# EAGLE design scheme (EAGLE 5.11)
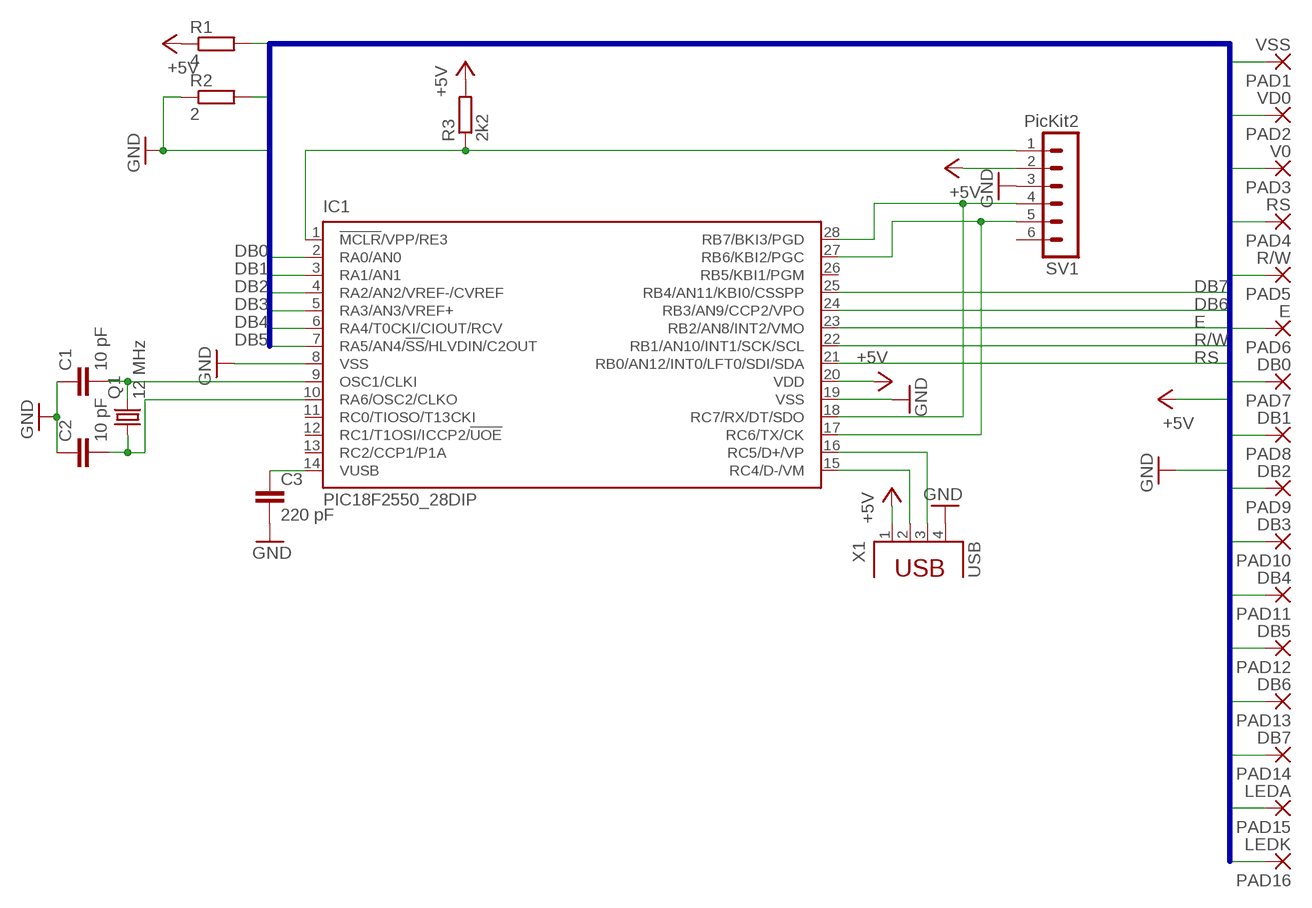
[diagram p0: schematic, sheet 1]

## Parts
C1  10 pF  C-EU050-024X044  [C050-024X044]
C2  10 pF  C-EU050-024X044  [C050-024X044]
C3  220 pF  C-EU050-024X044  [C050-024X044]
IC1  PIC18F2550_28DIP  [DIL28-3]
PAD1  VSS  2,54/0,9  [2,54/0,9]
PAD2  VD0  2,54/0,9  [2,54/0,9]
PAD3  V0  2,54/0,9  [2,54/0,9]
PAD4  RS  2,54/0,9  [2,54/0,9]
PAD5  R/W  2,54/0,9  [2,54/0,9]
PAD6  E  2,54/0,9  [2,54/0,9]
PAD7  DB0  2,54/0,9  [2,54/0,9]
PAD8  DB1  2,54/0,9  [2,54/0,9]
PAD9  DB2  2,54/0,9  [2,54/0,9]
PAD10  DB3  2,54/0,9  [2,54/0,9]
PAD11  DB4  2,54/0,9  [2,54/0,9]
PAD12  DB5  2,54/0,9  [2,54/0,9]
PAD13  DB6  2,54/0,9  [2,54/0,9]
PAD14  DB7  2,54/0,9  [2,54/0,9]
PAD15  LEDA  2,54/0,9  [2,54/0,9]
PAD16  LEDK  2,54/0,9  [2,54/0,9]
Q1  12 MHz  CRYSTALHC49S  [HC49/S]
R1  4  R-EU_0204/7  [0204/7]
R2  2  R-EU_0204/7  [0204/7]
R3  2k2  R-EU_0204/7  [0204/7]
SV1  PicKit2  MA06-1  [MA06-1]
X1  USB  PN87520  [PN87520]

## Nets
+5V: IC1.20(VDD) PAD2.1(P) R1.1 R3.2 SV1.2 X1.1
BACK: PAD15.1(P) R1.2
DB0: IC1.2(RA0/AN0) PAD7.1(P)
DB1: IC1.3(RA1/AN1) PAD8.1(P)
DB2: IC1.4(RA2/AN2/VREF-/CVREF) PAD9.1(P)
DB3: IC1.5(RA3/AN3/VREF+) PAD10.1(P)
DB4: IC1.6(RA4/T0CKI/CIOUT/RCV) PAD11.1(P)
DB5: IC1.7(RA5/AN4/!SS!/HLVDIN/C2OUT) PAD12.1(P)
DB6: IC1.24(RB3/AN9/CCP2/VPO) PAD13.1(P)
DB7: IC1.25(RB4/AN11/KBI0/CSSPP) PAD14.1(P)
E: IC1.23(RB2/AN8/INT2/VMO) PAD6.1(P)
GND: C1.1 C2.1 C3.2 IC1.8(VSS) IC1.19(VSS) PAD1.1(P) PAD16.1(P) R2.1 SV1.3 X1.4
N$1: C1.2 IC1.9(OSC1/CLKI) Q1.2
N$2: C2.2 IC1.10(RA6/OSC2/CLKO) Q1.1
N$3: IC1.15(RC4/D-/VM) X1.2
N$4: IC1.16(RC5/D+/VP) X1.3
N$5: IC1.1(!MCLR!/VPP/RE3) R3.1 SV1.1
N$6: IC1.18(RC7/RX/DT/SDO) IC1.28(RB7/BKI3/PGD) SV1.4
N$7: IC1.17(RC6/TX/CK) IC1.27(RB6/KBI2/PGC) SV1.5
N$8: C3.1 IC1.14(VUSB)
R/W: IC1.22(RB1/AN10/INT1/SCK/SCL) PAD5.1(P)
RS: IC1.21(RB0/AN12/INT0/LFT0/SDI/SDA) PAD4.1(P)
V0: PAD3.1(P) R2.2
Unconnected: IC1.11(RC0/TIOSO/T13CKI) IC1.12(RC1/T1OSI/ICCP2/!UOE) IC1.13(RC2/CCP1/P1A) IC1.26(RB5/KBI1/PGM) SV1.6

## Buses
GND,+5V,V0,RS,R/W,E,DB0,DB1,DB2,DB3,DB4,DB5,DB6,DB7,BACK,GND

## Library data of the parts
C1 C2 = resistor:C-EU: CAPACITOR, European symbol
C3 = rcl:C-EU: CAPACITOR, European symbol
IC1 = microchip:PIC18F2*_28: USB Microcontrollers with nanoWatt Technology High-Performance, Enhanced Flash, 28/40/44-Pin, Source: http://ww1.microchip.com/downloads/en/devicedoc/39632c.pdf; MF: MICROCHIP; MPN: PIC18F2550-I/SP; OC_FARNELL: 1523822; OC_NEWARK: 80K6054
PAD1-PAD16 = wirepad:2,54/0,9: THROUGH-HOLE PAD
Q1 = crystal:CRYSTAL: CRYSTAL; OC_FARNELL: 1667008; OC_NEWARK: unknown
R1-R3 = rcl:R-EU_: RESISTOR, European symbol
SV1 = con-lstb:MA06-1: PIN HEADER; OC_FARNELL: unknown; OC_NEWARK: unknown
X1 = con-berg:PN87520: BERG USB connector; OC_FARNELL: unknown; OC_NEWARK: unknown

## Board
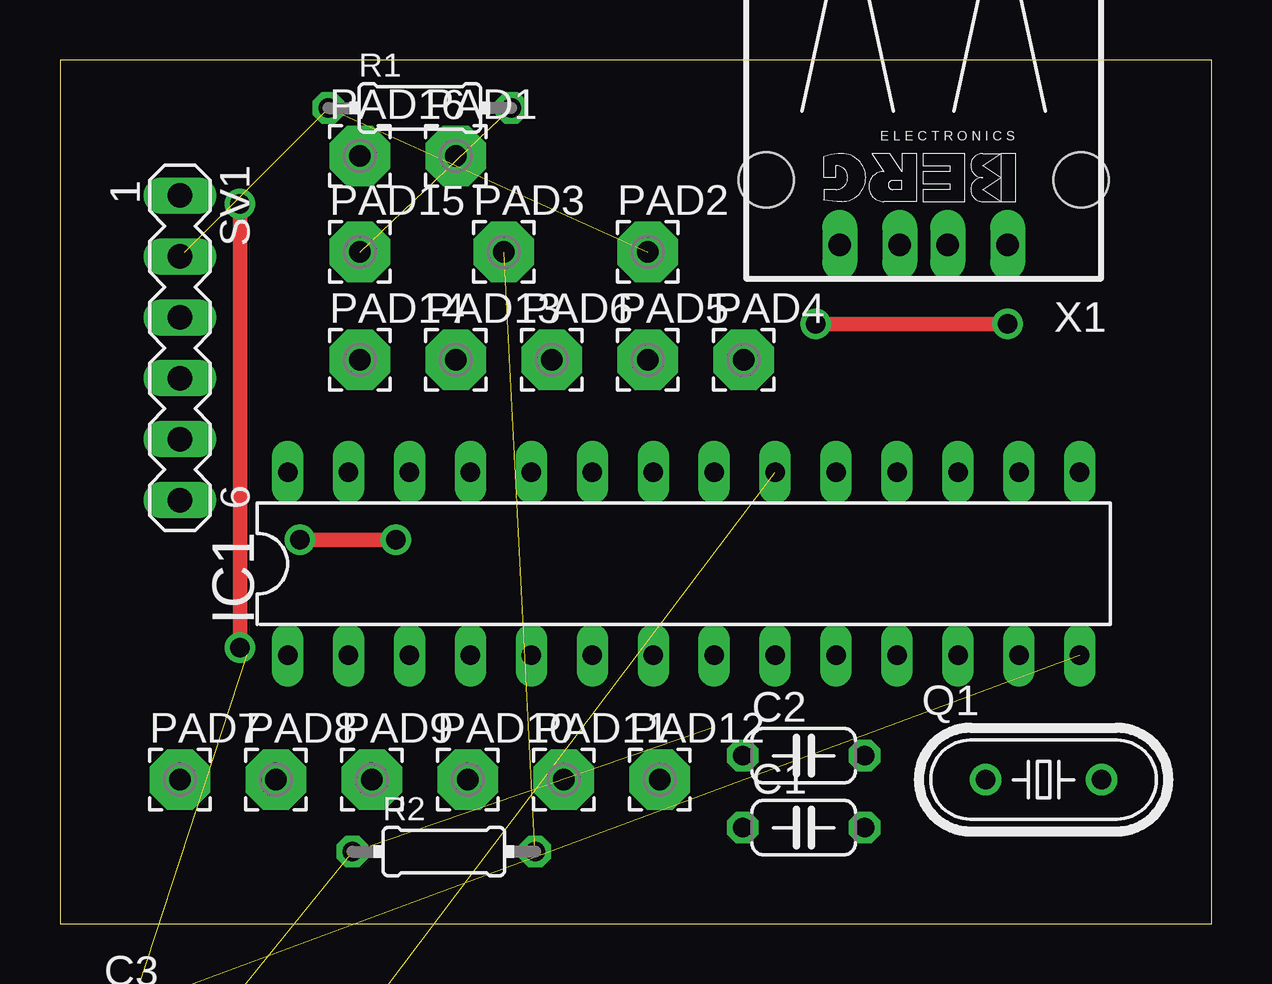
[diagram p1: board, top side]
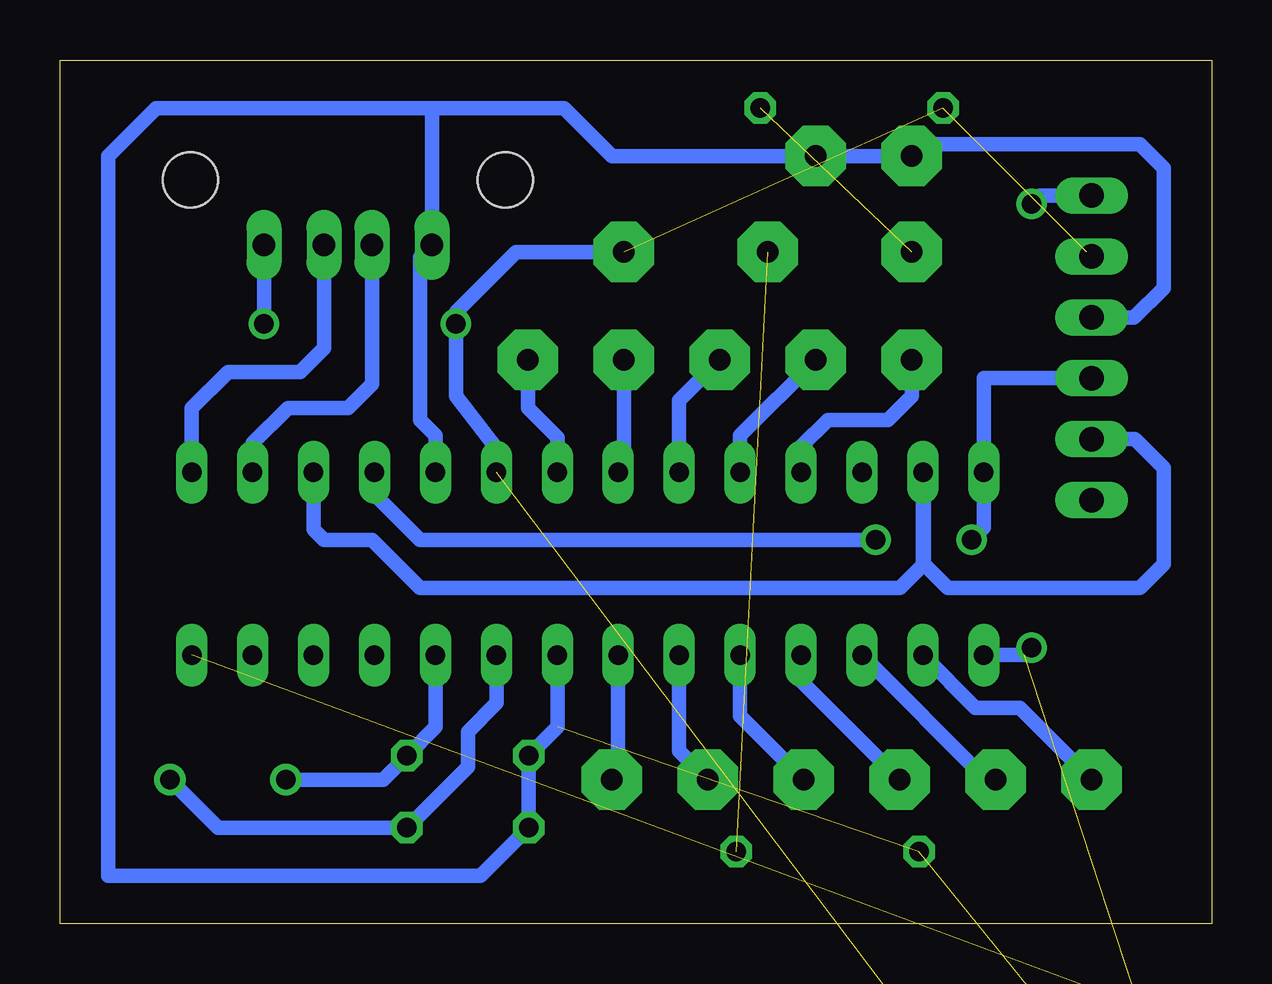
[diagram p2: board, bottom side, seen from below]

Size 48 x 36 mm. Coordinates in mm from the lower left corner, seen from the top.
Outline: 0,0 48,0 48,36 0,36 0,0
Copper layers (1*16): Top 0.035mm / dielectric 1.5mm / Bottom 0.035mm
Design rules "default": minimum track width 10mil, minimum drill 24mil, track to track 8mil, track to pad 8mil, pad to pad 8mil, via to via 8mil, smd to smd 8mil, copper to edge 40mil, drill to drill 8mil, minimum pad ring 10mil, minimum via ring 8mil, stop-mask expansion 4mil, vias tented up to drill 0mil, thermal gap 10mil

### Footprints (pad centres in the part's own frame; a part is rotated, then mirrored left to right if it is on the bottom)
C050-024X044 = drill 0.813 octagon: 1 -2.54,0; 2 2.54,0
DIL28-3 = drill 0.813 long: 1 -16.51,-3.81; 2 -13.97,-3.81; 3 -11.43,-3.81; 4 -8.89,-3.81; 5 -6.35,-3.81; 6 -3.81,-3.81; 7 -1.27,-3.81; 8 1.27,-3.81; 9 3.81,-3.81; 10 6.35,-3.81; 11 8.89,-3.81; 12 11.43,-3.81; 13 13.97,-3.81; 14 16.51,-3.81; 15 16.51,3.81; 16 13.97,3.81; 17 11.43,3.81; 18 8.89,3.81; 19 6.35,3.81; 20 3.81,3.81; 21 1.27,3.81; 22 -1.27,3.81; 23 -3.81,3.81; 24 -6.35,3.81; 25 -8.89,3.81; 26 -11.43,3.81; 27 -13.97,3.81; 28 -16.51,3.81
2,54/0,9 = drill 0.914 pad 2.54 octagon: 1 0,0
HC49/S = drill 0.813 round: 1 -2.413,0; 2 2.413,0
0204/7 = drill 0.813 octagon: 1 -3.81,0; 2 3.81,0
MA06-1 = drill 1.016 long: 1 -6.35,0; 2 -3.81,0; 3 -1.27,0; 4 1.27,0; 5 3.81,0; 6 6.35,0
PN87520 = drill 0.95 long: 1 -3.5,2.71; 2 -1,2.71; 3 1,2.71; 4 3.5,2.71 | hole 2.3: -6.57,0; 6.57,0

### Placement (x,y rotation side)
C1  31,4 0 top
C2  31,7 0 top
C3  4,-4 0 top  (outside the outline)
IC1  26,15 0 top
PAD1  16.5,32 0 top
PAD2  24.5,28 0 top
PAD3  18.5,28 0 top
PAD4  28.5,23.5 0 top
PAD5  24.5,23.5 0 top
PAD6  20.5,23.5 0 top
PAD7  5,6 0 top
PAD8  9,6 0 top
PAD9  13,6 0 top
PAD10  17,6 0 top
PAD11  21,6 0 top
PAD12  25,6 0 top
PAD13  16.5,23.5 0 top
PAD14  12.5,23.5 0 top
PAD15  12.5,28 0 top
PAD16  12.5,32 0 top
Q1  41,6 0 top
R1  15,34 0 top
R2  16,3 0 top
R3  5,-9 0 top  (outside the outline)
SV1  5,24 270 top
X1  36,31 180 top

### Tracks (layer width: path | path; a pad name or v marks a point on that pad's centre or on a via)
+5V  (via drill 0.8 pad 1.27)  (3 unrouted)
  Top 0.61: v31.5,25 v39.5,25
  Bottom 0.61: IC1.20 29.81,19.81 31.5,22 v31.5,25 31.5,25.5 29,28 PAD2.1 | v39.5,25 X1.1 | SV1.2 5.19,28
BACK  (1 unrouted)
DB0
  Bottom 0.61: IC1.2 9.84,9 8,9 PAD7.1
DB1
  Bottom 0.61: PAD8.1 9.38,6 IC1.3
DB2
  Bottom 0.61: PAD9.1 17.11,10.11 IC1.4
DB3
  Bottom 0.61: PAD10.1 19.65,8.65 IC1.5
DB4
  Bottom 0.61: PAD11.1 22.19,7.19 IC1.6
DB5
  Bottom 0.61: PAD12.1 24.73,6.27 IC1.7
DB6
  Bottom 0.61: IC1.24 19.65,20.35 PAD13.1
DB7
  Bottom 0.61: IC1.25 17.11,19.89 16,21 13.5,21 12.5,22 PAD14.1
E
  Bottom 0.61: IC1.23 22.19,21.81 PAD6.1
GND  (2 unrouted)
  Bottom 0.61: IC1.8 27.27,8.19 C2.1 C1.1 30.46,2 46,2 46,32 44,34 32.5,34 | X1.4 32.35,28.14 | IC1.19 32.35,20.35 33,21 33,27.79 X1.4 | SV1.3 3.23,25.27 2,26.5 2,31.5 3,32.5 12,32.5 PAD16.1 PAD1.1 25,32 27,34 32.5,34 | 32.5,34 X1.4
N$1
  Bottom 0.61: IC1.9 29.81,9.19 31,8 31,6.54 C1.2 41.41,4 Q1.2
N$2
  Bottom 0.61: IC1.10 32.35,8.19 C2.2 34.54,6 Q1.1
N$3
  Bottom 0.61: X1.2 37,24 38,23 41,23 42.51,21.49 IC1.15
N$4
  Bottom 0.61: X1.3 35,22.5 36,21.5 38.5,21.5 39.97,20.03 IC1.16
N$5  (via drill 0.8 pad 1.27)  (1 unrouted)
  Top 0.61: v7.5,11.5 v7.5,30
  Bottom 0.61: IC1.1 7.81,11.19 v7.5,11.5 | SV1.1 7.15,30.35 v7.5,30
N$6  (via drill 0.8 pad 1.27)
  Top 0.61: v10,16 v14,16
  Bottom 0.61: IC1.18 34.89,17.89 33,16 v14,16 | v10,16 9.49,16.51 IC1.28 9.49,22.73 SV1.4
N$7
  Bottom 0.61: IC1.17 37.43,16.43 37,16 35,16 33,14 13,14 12,15 12,18.78 IC1.27 12.03,15.03 11,14 3,14 2,15 2,19 3.19,20.19 SV1.5
N$8  (1 unrouted)
R/W
  Bottom 0.61: IC1.22 24.5,19.04 PAD5.1
RS
  Bottom 0.61: PAD4.1 28.5,21.5 27.27,20.27 IC1.21
V0  (1 unrouted)